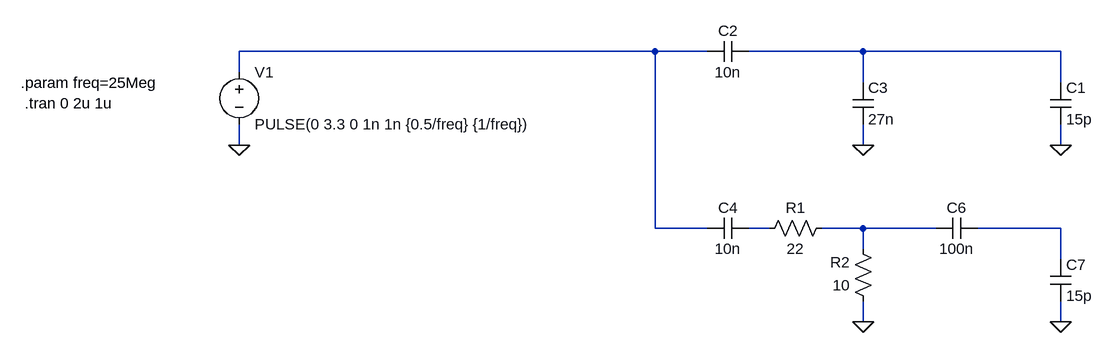
[diagram p0: schematic oscillator.asc]
oscillator.asc, the LTspice schematic file:
Version 4
SHEET 1 880 680
WIRE 128 112 -512 112
WIRE 208 112 128 112
WIRE 448 112 272 112
WIRE 752 112 448 112
WIRE -512 144 -512 112
WIRE 448 160 448 112
WIRE 752 160 752 112
WIRE -512 256 -512 224
WIRE 448 256 448 224
WIRE 752 256 752 224
WIRE 128 384 128 112
WIRE 208 384 128 384
WIRE 304 384 272 384
WIRE 448 384 384 384
WIRE 560 384 448 384
WIRE 752 384 624 384
WIRE 448 416 448 384
WIRE 752 432 752 384
WIRE 448 528 448 496
WIRE 752 528 752 496
FLAG -512 256 0
FLAG 752 256 0
FLAG 448 256 0
FLAG 752 528 0
FLAG 448 528 0
SYMBOL voltage -512 128 R0
WINDOW 123 0 0 Left 0
WINDOW 39 0 0 Left 0
SYMATTR InstName V1
SYMATTR Value PULSE(0 3.3 0 1n 1n {0.5/freq} {1/freq})
SYMBOL cap 736 160 R0
SYMATTR InstName C1
SYMATTR Value 15p
SYMBOL cap 272 96 R90
WINDOW 0 0 32 VBottom 2
WINDOW 3 32 32 VTop 2
SYMATTR InstName C2
SYMATTR Value 10n
SYMBOL cap 432 160 R0
SYMATTR InstName C3
SYMATTR Value 27n
SYMBOL cap 272 368 R90
WINDOW 0 0 32 VBottom 2
WINDOW 3 32 32 VTop 2
SYMATTR InstName C4
SYMATTR Value 10n
SYMBOL cap 624 368 R90
WINDOW 0 0 32 VBottom 2
WINDOW 3 32 32 VTop 2
SYMATTR InstName C6
SYMATTR Value 100n
SYMBOL cap 736 432 R0
SYMATTR InstName C7
SYMATTR Value 15p
SYMBOL res 400 368 R90
WINDOW 0 0 56 VBottom 2
WINDOW 3 32 56 VTop 2
SYMATTR InstName R1
SYMATTR Value 22
SYMBOL res 464 512 R180
WINDOW 0 36 76 Left 2
WINDOW 3 36 40 Left 2
SYMATTR InstName R2
SYMATTR Value 10
TEXT -848 160 Left 2 !.param freq=25Meg
TEXT -842 192 Left 2 !.tran 0 2u 1u

The netlist it stands for:
* oscillator.asc
V1 N001 0 PULSE(0 3.3 0 1n 1n {0.5/freq} {1/freq})
C1 N002 0 15p
C2 N002 N001 10n
C3 N002 0 27n
C4 N003 N001 10n
C6 N005 N004 100n
C7 N005 0 15p
R1 N004 N003 22
R2 0 N004 10
.param freq=25Meg
.tran 0 2u 1u
.backanno
.end